# Altium project pump_controller_project.PrjPcb (part 1 of 2)
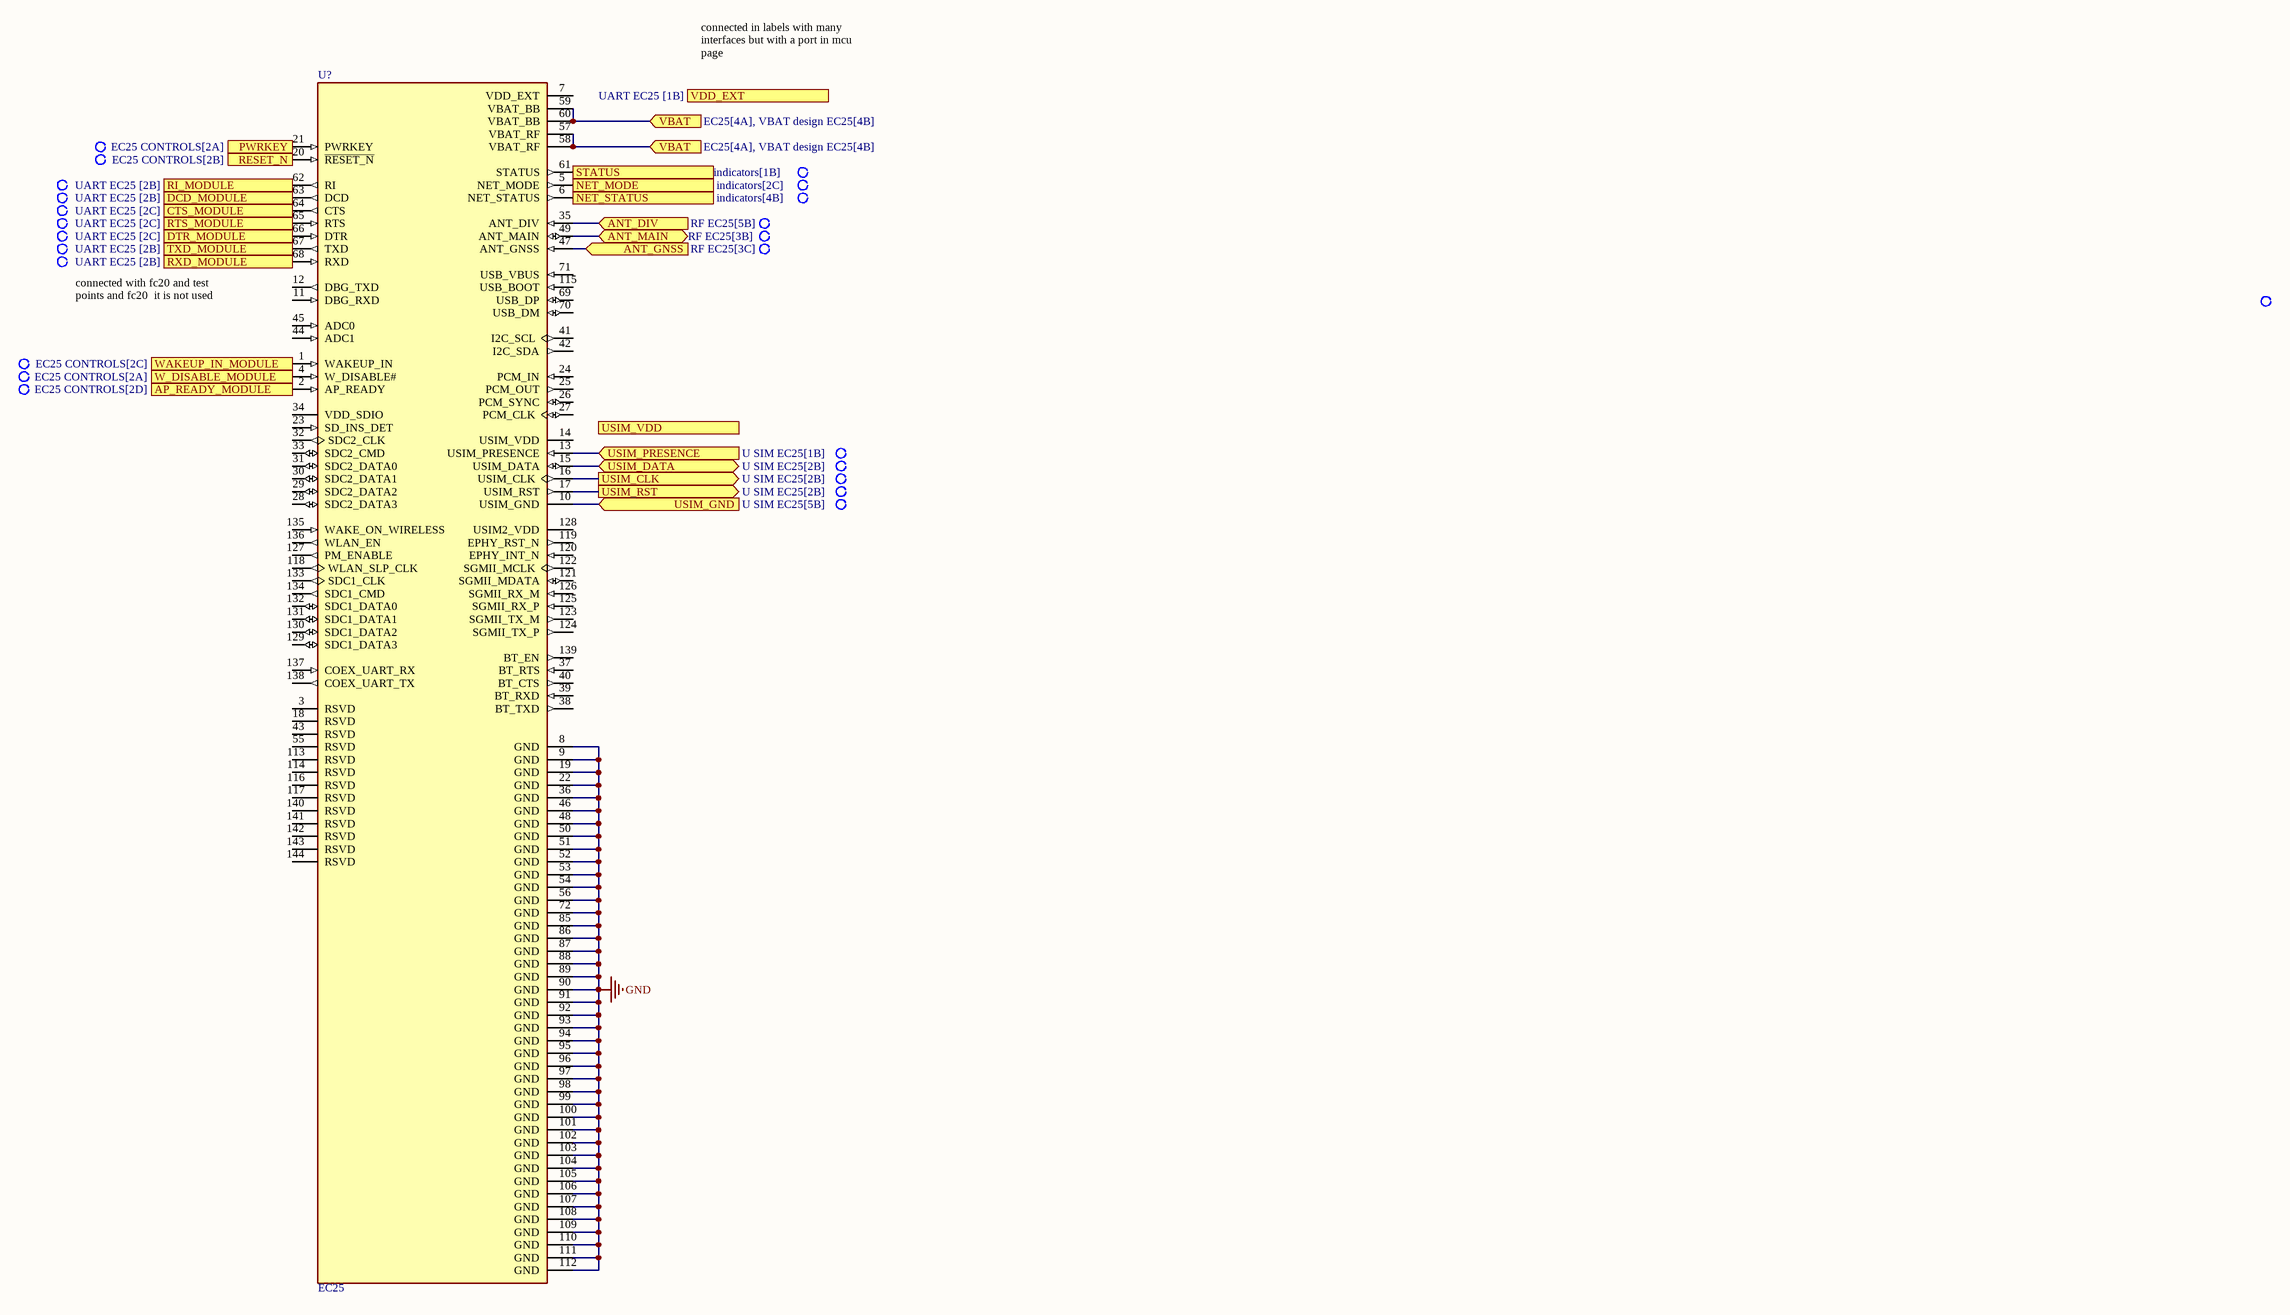
[diagram p0: EC25.SchDoc]
10 sheets, 163 parts. Net scope: flat (ports and power ports of the same name join across sheets).
Board file: PCB1.PcbDoc
Sheets:
  EC25.SchDoc
  UART EC25 .SchDoc
  LDO EC25.SchDoc
  U SIM EC25.SchDoc
  VBAT design EC25.SchDoc
  indicators.SchDoc
  ATWINC3400.SchDoc
  EC25 CONTROLS.SchDoc
  RF EC25.SchDoc
  MCU.SchDoc

## Sheet EC25.SchDoc
size C; SheetNumber: 4; SheetTotal: 10

### Parts
(Parts that share a designator on the sheet are numbered #1, #2 ... from top to bottom, then left to right.)
U?#1  EC25  [XCVR_EC25]

### Ports
ANT_DIV (in, see RF EC25[5B]), ANT_GNSS (in, see RF EC25[3C]), ANT_MAIN (bidir, see RF EC25[3B]), AP_READY_MODULE (in, see EC25 CONTROLS[2D]), CTS_MODULE (out, see UART EC25 [2C]), DCD_MODULE (out, see UART EC25 [2B]), DTR_MODULE (in, see UART EC25 [2C]), NET_MODE (out, see indicators[2C]), NET_STATUS (out, see indicators[4B]), PWRKEY (in, see EC25 CONTROLS[2A]), RESET_N (in, see EC25 CONTROLS[2B]), RI_MODULE (out, see UART EC25 [2B]), RTS_MODULE (in, see UART EC25 [2C]), RXD_MODULE (in, see UART EC25 [2B]), STATUS (out, see indicators[1B]), TXD_MODULE (out, see UART EC25 [2B]), USIM_CLK (out, see U SIM EC25[2B]), USIM_DATA (bidir, see U SIM EC25[2B]), USIM_GND (in, see U SIM EC25[5B]), USIM_PRESENCE (in, see U SIM EC25[1B]), USIM_RST (out, see U SIM EC25[2B]), USIM_VDD (out), VBAT (in, see EC25[4A], VBAT design EC25[4B]), VDD_EXT (out, see UART EC25 [1B]), W_DISABLE_MODULE (in, see EC25 CONTROLS[2A]), WAKEUP_IN_MODULE (in, see EC25 CONTROLS[2C])

### Nets
GND: U?#1.8(GND) U?#1.9(GND) U?#1.19(GND) U?#1.22(GND) U?#1.36(GND) U?#1.46(GND) U?#1.48(GND) U?#1.50(GND) U?#1.51(GND) U?#1.52(GND) U?#1.53(GND) U?#1.54(GND) U?#1.56(GND) U?#1.72(GND) U?#1.85(GND) U?#1.86(GND) U?#1.87(GND) U?#1.88(GND) U?#1.89(GND) U?#1.90(GND) U?#1.91(GND) U?#1.92(GND) U?#1.93(GND) U?#1.94(GND) U?#1.95(GND) U?#1.96(GND) U?#1.97(GND) U?#1.98(GND) U?#1.99(GND) U?#1.100(GND) U?#1.101(GND) U?#1.102(GND) U?#1.103(GND) U?#1.104(GND) U?#1.105(GND) U?#1.106(GND) U?#1.107(GND) U?#1.108(GND) U?#1.109(GND) U?#1.110(GND) U?#1.111(GND) U?#1.112(GND)  [project net VSS_1]
VBAT: U?#1.57(VBAT_RF) U?#1.58(VBAT_RF) U?#1.59(VBAT_BB) U?#1.60(VBAT_BB) ; port VBAT
NetC?#7_2: U?#1.10(USIM_GND) ; port USIM_GND
NetC?#23_2: U?#1.49(ANT_MAIN) ; port ANT_MAIN
NetC?#25_2: U?#1.35(ANT_DIV) ; port ANT_DIV
NetC?#27_1: U?#1.47(ANT_GNSS) ; port ANT_GNSS
NetD?#2_5: U?#1.13(USIM_PRESENCE) ; port USIM_PRESENCE
NetIC?#1_3: U?#1.63(DCD) ; port DCD_MODULE
NetIC?#1_4: U?#1.67(TXD) ; port TXD_MODULE
NetIC?#1_5: U?#1.68(RXD) ; port RXD_MODULE
NetIC?#1_6: U?#1.62(RI) ; port RI_MODULE
NetIC?#1_7: U?#1.66(DTR) ; port DTR_MODULE
NetIC?#1_8: U?#1.64(CTS) ; port CTS_MODULE
NetIC?#1_9: U?#1.65(RTS) ; port RTS_MODULE
NetQ?#3_1: U?#1.6(NET_STATUS) ; port NET_STATUS
NetQ?#4_1: U?#1.5(NET_MODE) ; port NET_MODE
NetQ?#5_3: U?#1.21(PWRKEY) ; port PWRKEY
NetQ?#6_3: U?#1.4(W_DISABLE#) ; port W_DISABLE_MODULE
NetQ?#7_3: U?#1.20(~{RESET_N}) ; port RESET_N
NetQ?#8_3: U?#1.1(WAKEUP_IN) ; port WAKEUP_IN_MODULE
NetQ?#9_3: U?#1.2(AP_READY) ; port AP_READY_MODULE
NetR?#9_1: U?#1.17(USIM_RST) ; port USIM_RST
NetR?#10_1: U?#1.16(USIM_CLK) ; port USIM_CLK
NetR?#11_1: U?#1.15(USIM_DATA) ; port USIM_DATA
NetR?#13_1: U?#1.61(STATUS) ; port STATUS

Not connected (* = marked no-connect by the designer): U?#1 3(RSVD) 7(VDD_EXT) 11(DBG_RXD) 12(DBG_TXD) 14(USIM_VDD) 18(RSVD) 23(SD_INS_DET) 24(PCM_IN) 25(PCM_OUT) 26(PCM_SYNC) 27(PCM_CLK) 28(SDC2_DATA3) 29(SDC2_DATA2) 30(SDC2_DATA1) 31(SDC2_DATA0) 32(SDC2_CLK) 33(SDC2_CMD) 34(VDD_SDIO) 37(BT_RTS) 38(BT_TXD) 39(BT_RXD) 40(BT_CTS) 41(I2C_SCL) 42(I2C_SDA) 43(RSVD) 44(ADC1) 45(ADC0) 55(RSVD) 69(USB_DP) 70(USB_DM) 71(USB_VBUS) 113(RSVD) 114(RSVD) 115(USB_BOOT) 116(RSVD) 117(RSVD) 118(WLAN_SLP_CLK) 119(EPHY_RST_N) 120(EPHY_INT_N) 121(SGMII_MDATA) 122(SGMII_MCLK) 123(SGMII_TX_M) 124(SGMII_TX_P) 125(SGMII_RX_P) 126(SGMII_RX_M) 127(PM_ENABLE) 128(USIM2_VDD) 129(SDC1_DATA3) 130(SDC1_DATA2) 131(SDC1_DATA1) 132(SDC1_DATA0) 133(SDC1_CLK) 134(SDC1_CMD) 135(WAKE_ON_WIRELESS) 136(WLAN_EN) 137(COEX_UART_RX) 138(COEX_UART_TX) 139(BT_EN) 140(RSVD) 141(RSVD) 142(RSVD) 143(RSVD) 144(RSVD)

### Notes on the sheet
- connected in labels with many interfaces but with a port in mcu page
- connected with fc20 and test points and fc20  it is not used

### Library data of the parts
U?#1 = EC25: LTE Cat 4 module; 32.0mm 29.0mm 2.4mm; Max. 150Mbps downlink / 50Mbps uplink; LCC form factor; Extended temperature range of -40C to +85C.; MF: Quectel; Availability: In Stock; Check_prices: https://www.snapeda.com/parts/EC25/Quectel/view-part/?ref=eda; Package: Custom Quectel; SnapEDA_Link: https://www.snapeda.com/parts/EC25/Quectel/view-part/?ref=snap; MP: EC25; Price: None; Value: *

## Sheet UART EC25 .SchDoc
size A; SheetNumber: 1; SheetTotal: 9
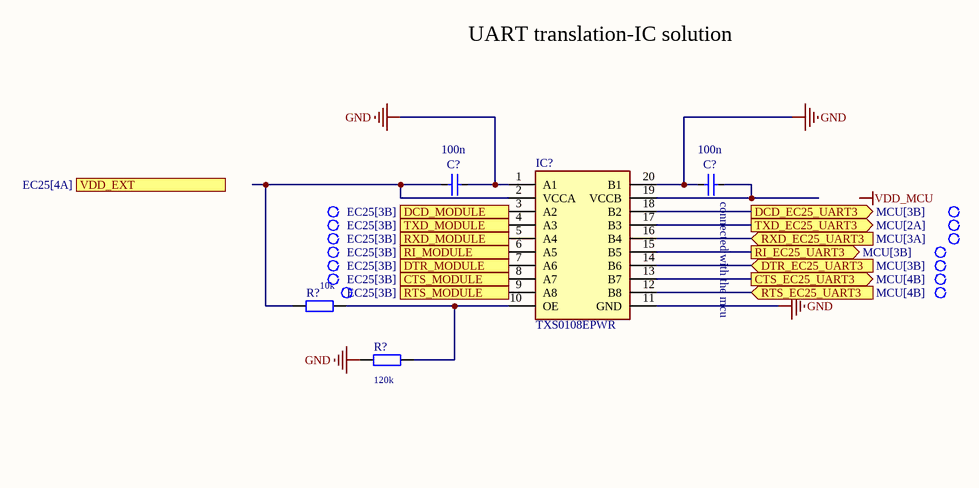
[diagram p1: UART EC25 .SchDoc]

### Parts
(Parts that share a designator on the sheet are numbered #1, #2 ... from top to bottom, then left to right.)
C?#1  value 100n  [CAPC1005X06N]  (hidden comment: C)
C?#2  value 100n  [CAPC1005X06N]  (hidden comment: C)
IC?#1  TXS0108EPWR  [SOP65P640X120-20N]
R?#1  value 10k  [RESC1005X04N]  (hidden comment: R)
R?#2  value 120k  [RESC1005X04N]  (hidden comment: R)

### Ports
CTS_EC25_UART3 (out, see MCU[4B]), CTS_MODULE (in, see EC25[3B]), DCD_EC25_UART3 (out, see MCU[3B]), DCD_MODULE (in, see EC25[3B]), DTR_EC25_UART3 (in, see MCU[3B]), DTR_MODULE (out, see EC25[3B]), RI_EC25_UART3 (out, see MCU[3B]), RI_MODULE (in, see EC25[3B]), RTS_EC25_UART3 (in, see MCU[4B]), RTS_MODULE (out, see EC25[3B]), RXD_EC25_UART3 (in, see MCU[3A]), RXD_MODULE (out, see EC25[3B]), TXD_EC25_UART3 (out, see MCU[2A]), TXD_MODULE (in, see EC25[3B]), VDD_EXT (in, see EC25[4A])

### Nets
GND: C?#1.2 C?#2.1 IC?#1.1(A1) IC?#1.11(GND) IC?#1.20(B1) R?#2.1  [project net VSS_1]
NetC?#1_1: C?#1.1 IC?#1.2(VCCA) R?#1.1
NetC?#2_2: C?#2.2 IC?#1.19(VCCB)
NetIC?#1_3: IC?#1.3(A2) ; port DCD_MODULE
NetIC?#1_4: IC?#1.4(A3) ; port TXD_MODULE
NetIC?#1_5: IC?#1.5(A4) ; port RXD_MODULE
NetIC?#1_6: IC?#1.6(A5) ; port RI_MODULE
NetIC?#1_7: IC?#1.7(A6) ; port DTR_MODULE
NetIC?#1_8: IC?#1.8(A7) ; port CTS_MODULE
NetIC?#1_9: IC?#1.9(A8) ; port RTS_MODULE
NetIC?#1_10: IC?#1.10(OE) R?#1.2 R?#2.2
NetIC?#1_12: IC?#1.12(B8) ; port RTS_EC25_UART3
NetIC?#1_13: IC?#1.13(B7) ; port CTS_EC25_UART3
NetIC?#1_14: IC?#1.14(B6) ; port DTR_EC25_UART3
NetIC?#1_15: IC?#1.15(B5) ; port RI_EC25_UART3
NetIC?#1_16: IC?#1.16(B4) ; port RXD_EC25_UART3
NetIC?#1_17: IC?#1.17(B3) ; port TXD_EC25_UART3
NetIC?#1_18: IC?#1.18(B2) ; port DCD_EC25_UART3

### Notes on the sheet
- UART translation-IC solution
- (near C?#2) connected with the mcu
- Labels drawn without touching a wire or pin: VDD_MCU

### Library data of the parts
IC?#1 = TXS0108EPWR: Integrated Circuit; Manufacturer_Name: Texas Instruments; Datasheet Link: http://www.ti.com/lit/ds/symlink/txs0108e.pdf; Height: 1.2mm; Manufacturer_Part_Number: TXS0108EPWR; Mouser Part Number: 595-TXS0108EPWR; Mouser Price/Stock: https://www.mouser.co.uk/ProductDetail/Texas-Instruments/TXS0108EPWR?qs=IUbkBnfnSQLgiWtCbWtYOw%3D%3D; Arrow Part Number: TXS0108EPWR; Arrow Price/Stock: https://www.arrow.com/en/products/txs0108epwr/texas-instruments?utm_currency=USD&region=nac
C?#1 C?#2 = C: MPN: *; Link: *
R?#1 R?#2 = R: MPN: *; Link: *

## Sheet LDO EC25.SchDoc
size A; SheetNumber: 2; SheetTotal: 9
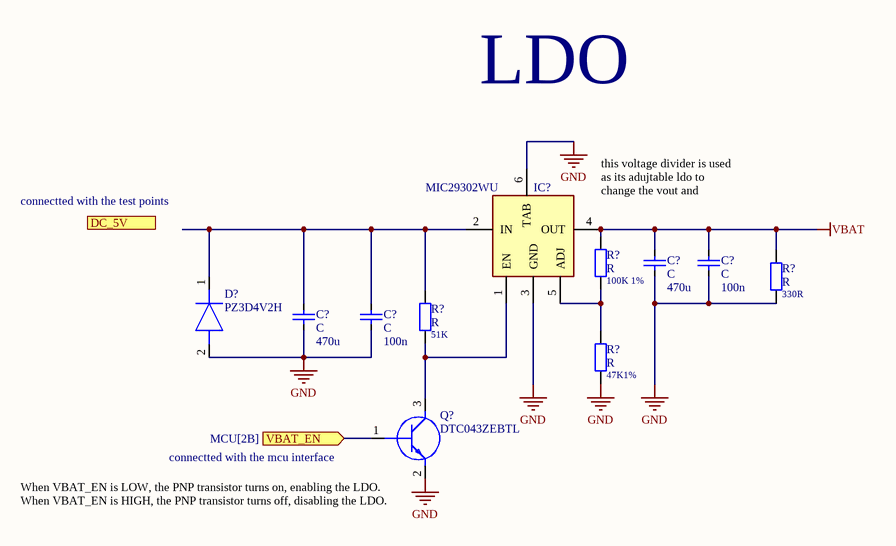
[diagram p2: LDO EC25.SchDoc]

### Parts
(Parts that share a designator on the sheet are numbered #1, #2 ... from top to bottom, then left to right.)
C?#3  C  value 470u  [CAPC1005X06N]
C?#4  C  value 100n  [CAPC1005X06N]
C?#5  C  value 470u  [CAPC1005X06N]
C?#6  C  value 100n  [CAPC1005X06N]
D?#1  PZ3D4V2H  [PZ3D4V2H]
IC?#2  MIC29302WU  [MIC29302WU]
Q?#1  DTC043ZEBTL  [SOTFL50P160X85-3N]
R?#3  R  value 100K 1%  [RESC1005X04N]
R?#4  R  value 330R  [RESC1005X04N]
R?#5  R  value 51K  [RESC1005X04N]
R?#6  R  value 47K1%  [RESC1005X04N]

### Ports
DC_5V (in), VBAT_EN (in, see MCU[2B])

### Nets
GND: C?#3.1 C?#4.1 C?#5.1 C?#6.1 D?#1.2(A) IC?#2.3(GND) IC?#2.6(TAB) Q?#1.2(E) R?#4.1 R?#6.1  [project net VSS_1]
VBAT: C?#3.2 C?#4.2 IC?#2.4(OUT) R?#3.2 R?#4.2
NetC?#5_2: C?#5.2 C?#6.2 D?#1.1(K) IC?#2.2(IN) R?#5.2
NetIC?#2_1: IC?#2.1(EN) Q?#1.3(C) R?#5.1
NetIC?#2_5: IC?#2.5(ADJ) R?#3.1 R?#6.2
NetIC?#4_8: Q?#1.1(B) ; port VBAT_EN

### Notes on the sheet
- LDO
- connectted with the test points
- (near IC?#2) this voltage divider is used as its adujtable ldo to change the vout and following the equation shown in the data sheet
- (near Q?#1) connectted with the mcu interface
- (near Q?#1) When VBAT_EN is LOW, the PNP transistor turns on, enabling the LDO.
  When VBAT_EN is HIGH, the PNP transistor turns off, disabling the LDO.

### Library data of the parts
D?#1 = PZ3D4V2H: Diode; Manufacturer_Name: Prisemi; Datasheet Link: http://www.prisemi.com/UploadImage/files/Zener/PZ3D4V2H.pdf; Height: 1mm; Manufacturer_Part_Number: PZ3D4V2H
IC?#2 = MIC29302WU: Integrated Circuit; Manufacturer_Name: Microchip; Datasheet Link: https://www.mouser.in/datasheet/2/268/MIC2915x_30x_50x_75x_High_Current_Low_Dropout_Regu-1889172.pdf; Height: 5.08mm; Manufacturer_Part_Number: MIC29302WU; Mouser Part Number: 998-MIC29302WU; Mouser Price/Stock: https://www.mouser.co.uk/ProductDetail/Microchip-Technology/MIC29302WU?qs=kh6iOki%2FeLGH5fS1ZBQ3pA%3D%3D; Arrow Part Number: MIC29302WU; Arrow Price/Stock: https://www.arrow.com/en/products/mic29302wu/microchip-technology?region=nac
Q?#1 = DTC043ZEBTL: Transistor BJT NPN; Manufacturer_Name: ROHM Semiconductor; Datasheet Link: http://rohmfs.rohm.com/en/products/databook/datasheet/discrete/transistor/digital/dtc043zmt2l-e.pdf; Height: 0.85mm; Manufacturer_Part_Number: DTC043ZEBTL; Mouser Part Number: 755-DTC043ZEBTL; Mouser Price/Stock: https://www.mouser.co.uk/ProductDetail/ROHM-Semiconductor/DTC043ZEBTL?qs=n7vHx8wJlDGyWrBOh0icRQ%3D%3D
C?#3-C?#6 = C: MPN: *; Link: *
R?#3-R?#6 = R: MPN: *; Link: *

## Sheet U SIM EC25.SchDoc
size 381 x 241 mm; SheetNumber: 5; SheetTotal: 9
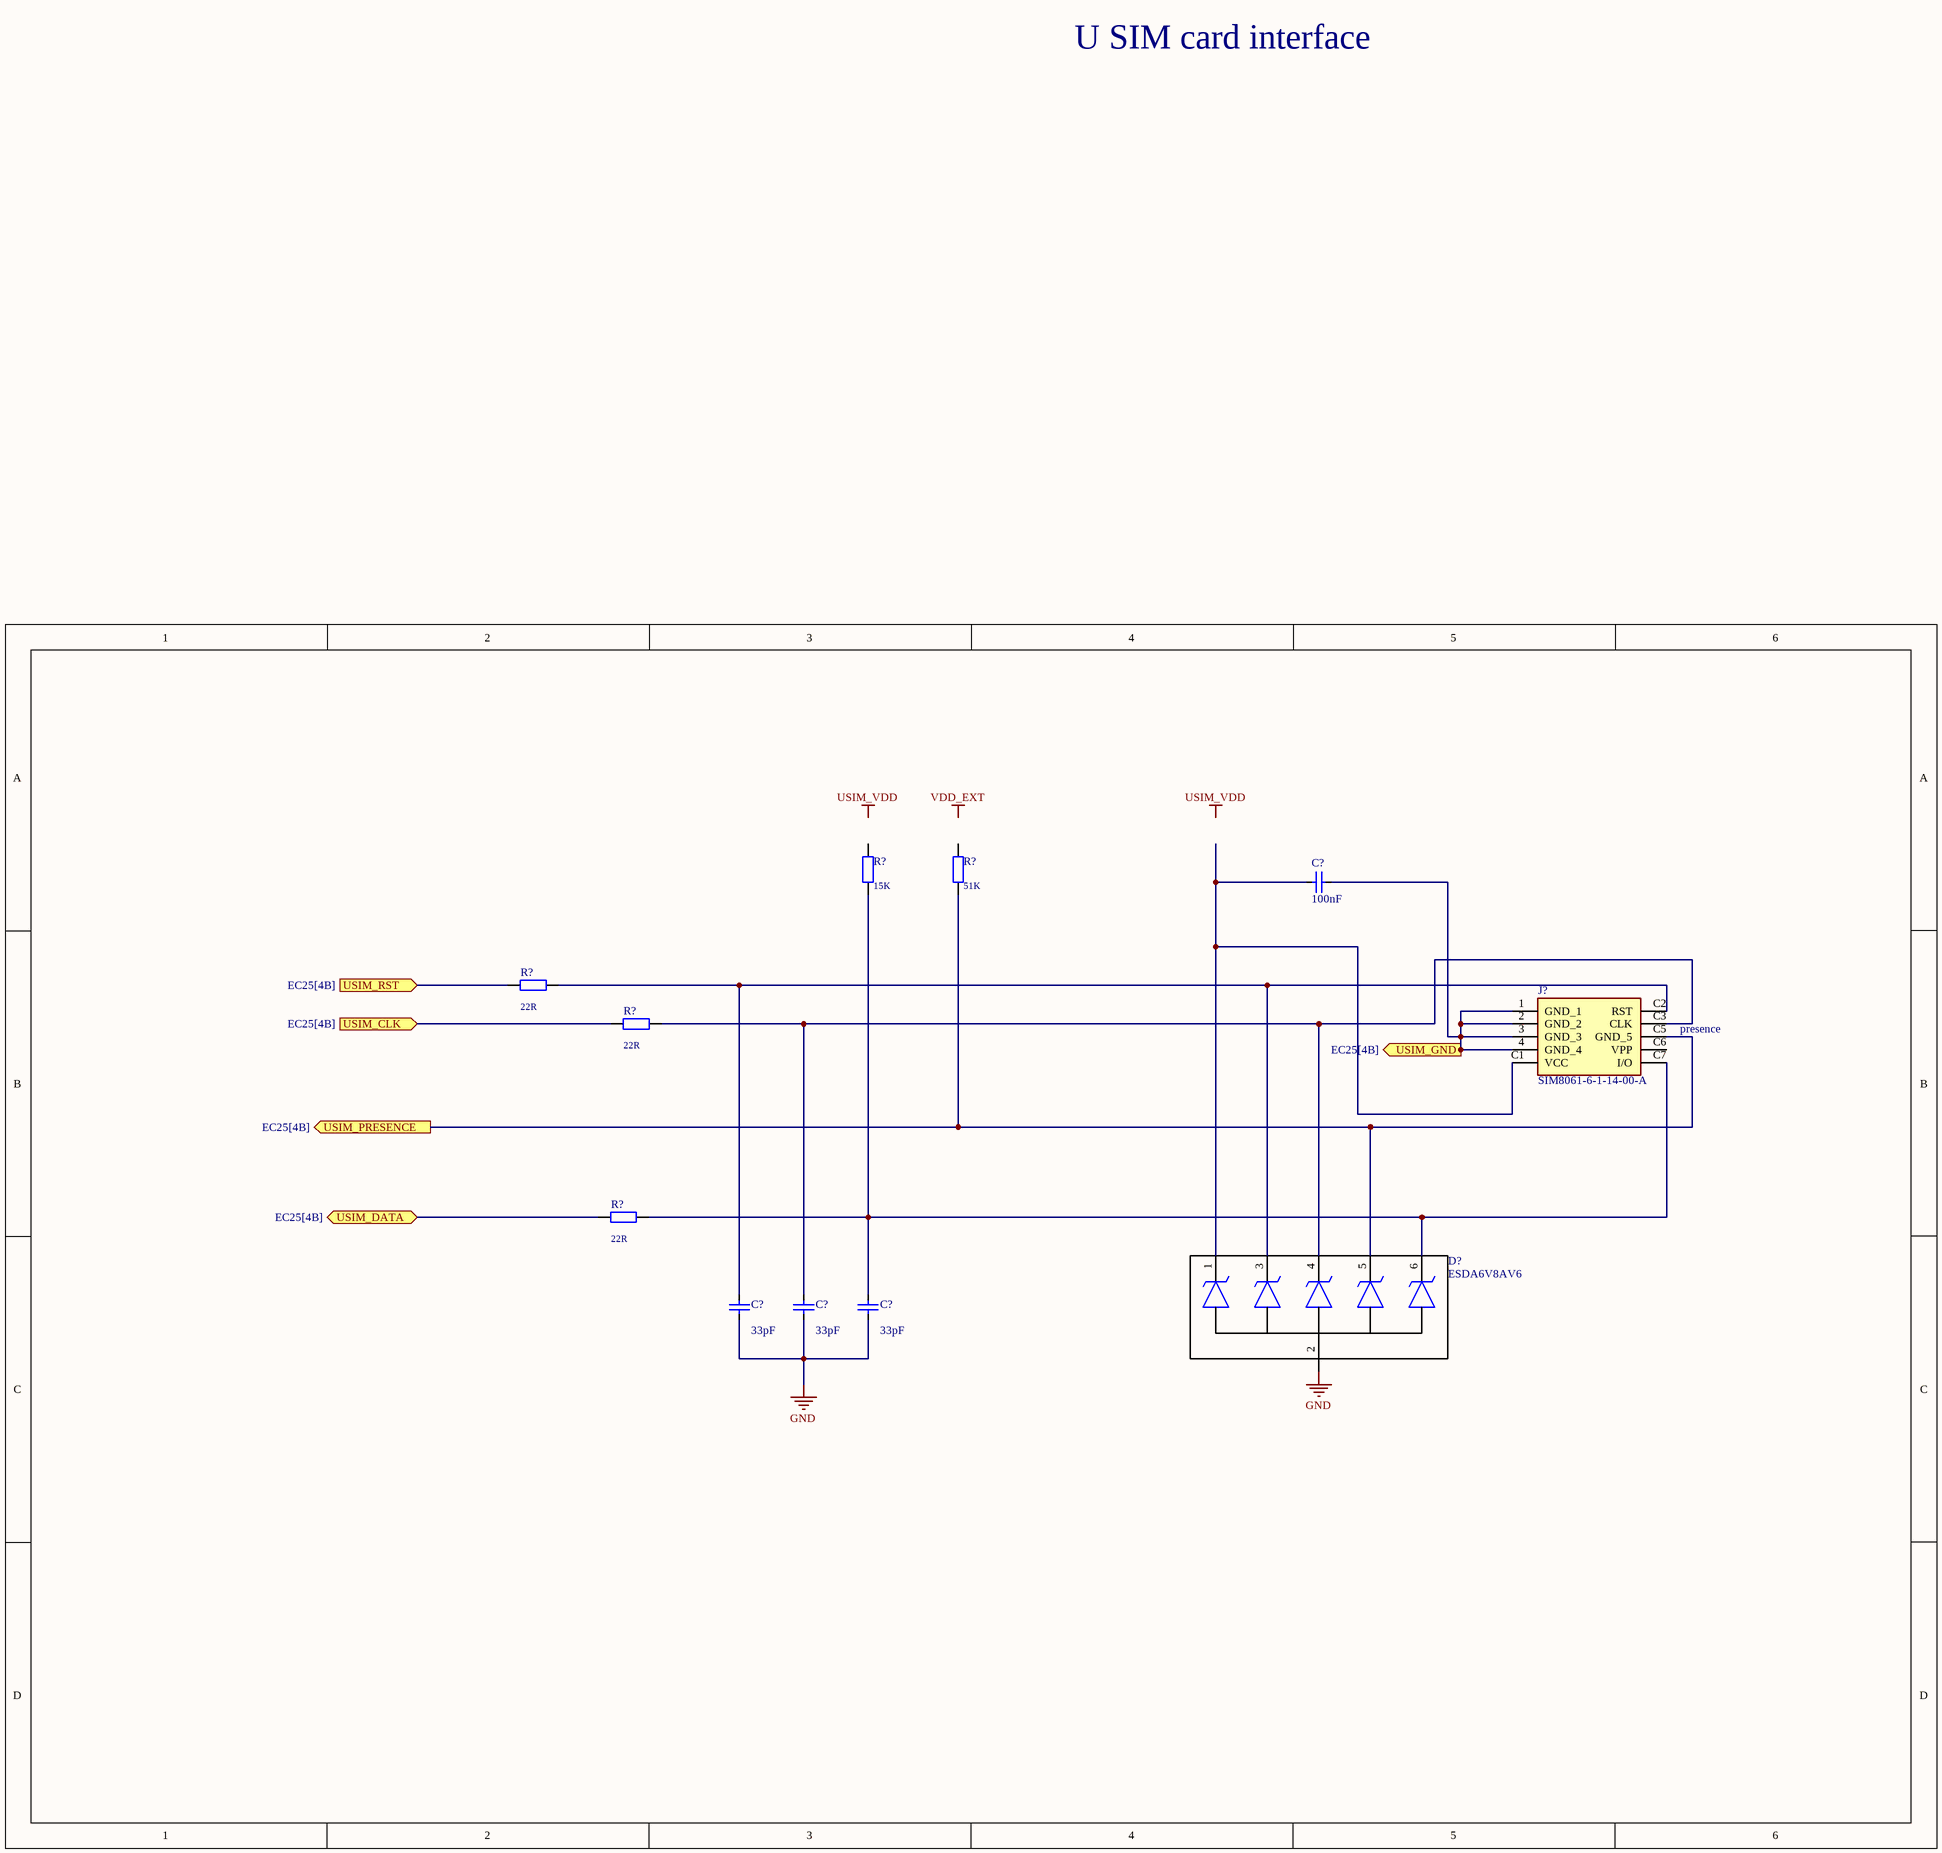
[diagram p3: U SIM EC25.SchDoc]

### Parts
(Parts that share a designator on the sheet are numbered #1, #2 ... from top to bottom, then left to right.)
C?#7  value 100nF  [CAPC1608X09N]  (hidden comment: C)
C?#8  value 33pF  [CAPC1608X09N]  (hidden comment: C)
C?#9  value 33pF  [CAPC1608X09N]  (hidden comment: C)
C?#10  value 33pF  [CAPC1608X09N]  (hidden comment: C)
D?#2  ESDA6V8AV6  [SOTFL50P160X60-6N]
J?#1  SIM8061-6-1-14-00-A  [SIM8061611400A]
R?#7  value 15K  [RESC1005X04N]  (hidden comment: R)
R?#8  value 51K  [RESC1005X04N]  (hidden comment: R)
R?#9  value 22R  [RESC1005X04N]  (hidden comment: R)
R?#10  value 22R  [RESC1005X04N]  (hidden comment: R)
R?#11  value 22R  [RESC1005X04N]  (hidden comment: R)

### Ports
USIM_CLK (in, see EC25[4B]), USIM_DATA (bidir, see EC25[4B]), USIM_GND (out, see EC25[4B]), USIM_PRESENCE (out, see EC25[4B]), USIM_RST (in, see EC25[4B])

### Nets
GND: C?#8.1 C?#9.1 C?#10.1 D?#2.2  [project net VSS_1]
NetC?#7_1: C?#7.1 D?#2.1 J?#1.C1(VCC)
NetC?#7_2: C?#7.2 J?#1.1(GND_1) J?#1.2(GND_2) J?#1.3(GND_3) J?#1.4(GND_4) ; port USIM_GND
NetC?#8_2: C?#8.2 D?#2.3 J?#1.C2(RST) R?#9.2
NetC?#9_2: C?#9.2 D?#2.4 J?#1.C3(CLK) R?#10.2
NetC?#10_2: C?#10.2 D?#2.6 J?#1.C7(I/O) R?#7.1 R?#11.2
NetD?#2_5: D?#2.5 J?#1.C5(GND_5) R?#8.1 ; port USIM_PRESENCE
NetR?#9_1: R?#9.1 ; port USIM_RST
NetR?#10_1: R?#10.1 ; port USIM_CLK
NetR?#11_1: R?#11.1 ; port USIM_DATA

Not connected (* = marked no-connect by the designer): J?#1 C6(VPP); R?#7 2; R?#8 2

### Notes on the sheet
- U SIM card interface
- (near J?#1) presence
- Labels drawn without touching a wire or pin: USIM_VDD, VDD_EXT

### Library data of the parts
D?#2 = ESDA6V8AV6: TVS Diode (Bi-directional); Manufacturer_Name: Will Semiconductor; Datasheet Link: http://www.chinesechip.com/files/2015-06/c6e5fabb-2b46-4fb6-8cff-c88a4d044cb1.pdf; Height: 0.6mm; Manufacturer_Part_Number: ESDA6V8AV6
J?#1 = SIM8061-6-1-14-00-A: Connector; Manufacturer_Name: GCT (GLOBAL CONNECTOR TECHNOLOGY); Datasheet Link: https://gct.co/connector/sim8061; Height: 1.58mm; Manufacturer_Part_Number: SIM8061-6-1-14-00-A; Mouser Part Number: 640-SIM8061611400A; Mouser Price/Stock: https://www.mouser.co.uk/ProductDetail/GCT/SIM8061-6-1-14-00-A?qs=%252BHhoWzUJg4JGbTNvJVYngw%3D%3D
C?#7-C?#10 = C: MPN: *; Link: *
R?#7-R?#11 = R: MPN: *; Link: *

## Sheet VBAT design EC25.SchDoc
size A; SheetNumber: 3; SheetTotal: 9
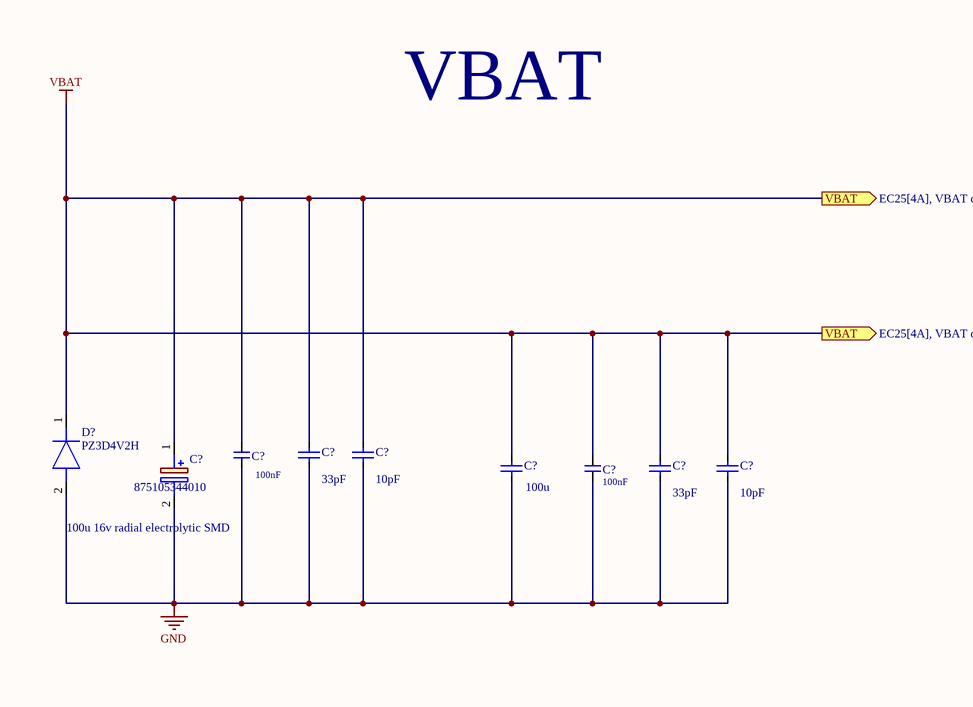
[diagram p4: VBAT design EC25.SchDoc, left]
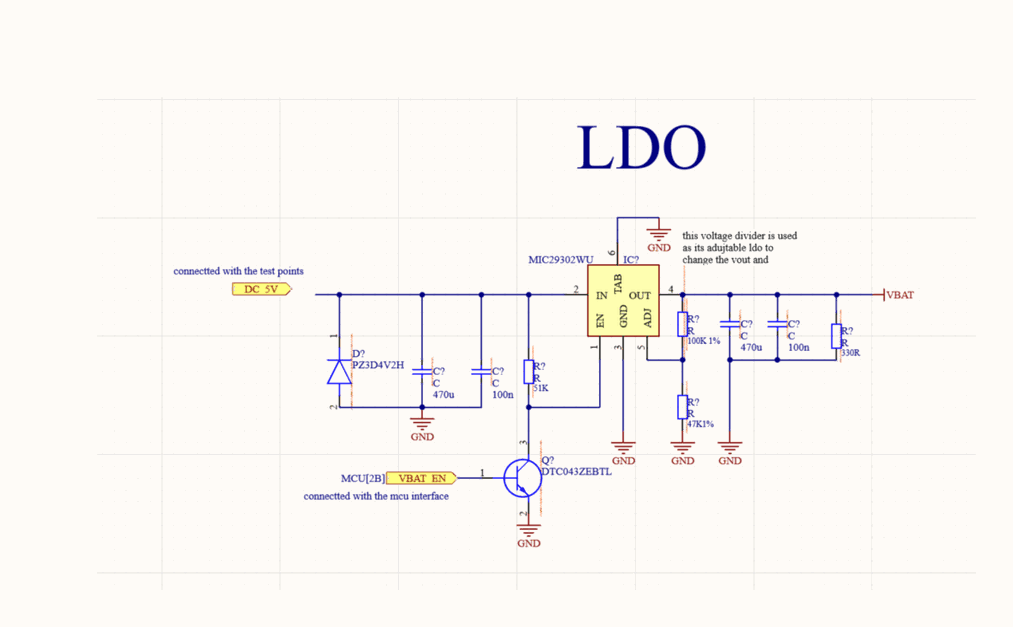
[diagram p5: VBAT design EC25.SchDoc, right]

### Parts
(Parts that share a designator on the sheet are numbered #1, #2 ... from top to bottom, then left to right.)
C?#11  875105344010  [CAPAE660X580N]
C?#12  value 100nF  [CAPC1005X06N]  (hidden comment: Cap)
C?#13  value 33pF  [CAPC1608X09N]  (hidden comment: C)
C?#14  value 10pF  [CAPC1608X09N]  (hidden comment: C)
C?#15  value 100nF  [CAPC1005X06N]  (hidden comment: Cap)
C?#16  value 100u  [CAPC1608X09N]  (hidden comment: C)
C?#17  value 33pF  [CAPC1608X09N]  (hidden comment: C)
C?#18  value 10pF  [CAPC1608X09N]  (hidden comment: C)
D?#3  PZ3D4V2H  [PZ3D4V2H]

### Ports
VBAT (out, see EC25[4A], VBAT design EC25[4B])

### Nets
GND: C?#11.2(-) C?#12.2 C?#13.1 C?#14.1 C?#15.2 C?#16.1 C?#17.1 C?#18.1 D?#3.2(A)  [project net VSS_1]
VBAT: C?#11.1(+) C?#12.1 C?#13.2 C?#14.2 C?#15.1 C?#16.2 C?#17.2 C?#18.2 D?#3.1(K) ; port VBAT

### Notes on the sheet
- VBAT
- 100u 16v radial electrolytic SMD

### Library data of the parts
C?#11 = 875105344010: Capacitor Polarised; Manufacturer_Name: Wurth Elektronik; Datasheet Link: https://katalog.we-online.de/pbs/datasheet/875105344010.pdf; Height: 5.8mm; Manufacturer_Part_Number: 875105344010; Mouser Part Number: 710-875105344010; Mouser Price/Stock: https://www.mouser.co.uk/ProductDetail/Wurth-Elektronik/875105344010?qs=0KOYDY2FL2%2F64TGt8E3UEQ%3D%3D
C?#12 C?#15 = Cap: Capacitor; MPN: GCM155R71H104KE02D; Link: https://jlcpcb.com/partdetail/MurataElectronics-GCM155R71H104KE02D/C85858; Price: 0.0031
D?#3 = PZ3D4V2H: Diode; Manufacturer_Name: Prisemi; Datasheet Link: http://www.prisemi.com/UploadImage/files/Zener/PZ3D4V2H.pdf; Height: 1mm; Manufacturer_Part_Number: PZ3D4V2H
C?#13 C?#14 C?#16-C?#18 = C: MPN: *; Link: *

## Sheet indicators.SchDoc
size A4; SheetNumber: 5; SheetTotal: 9
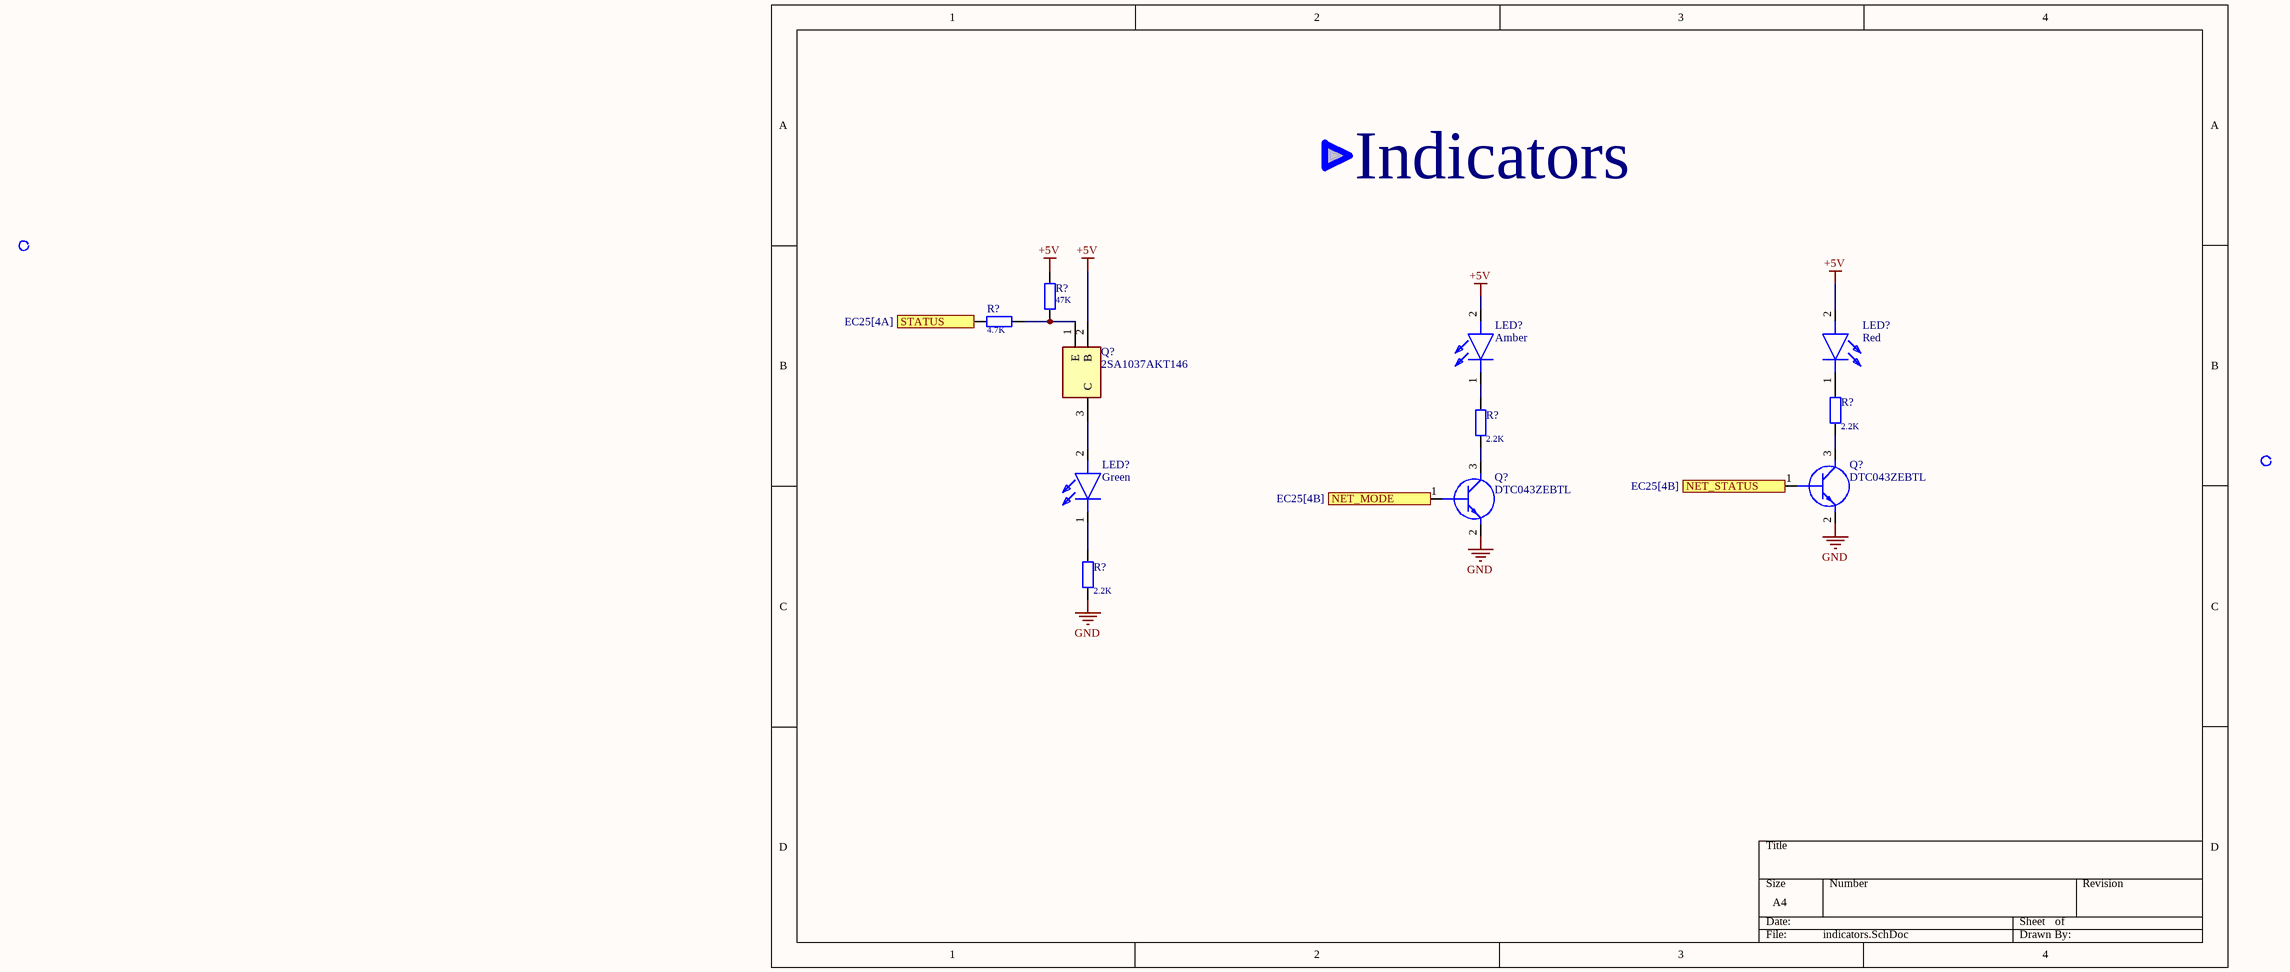
[diagram p6: indicators.SchDoc]

### Parts
(Parts that share a designator on the sheet are numbered #1, #2 ... from top to bottom, then left to right.)
LED?#1  Amber  [LEDC1608X80N]
LED?#2  Red  [LEDC1608X80N]
LED?#3  Green  [LEDC1608X80N]
Q?#2  2SA1037AKT146  [DTB123YKT146]
Q?#3  DTC043ZEBTL  [SOTFL50P160X85-3N]
Q?#4  DTC043ZEBTL  [SOTFL50P160X85-3N]
R?#12  value 47K  [RESC1005X04N]  (hidden comment: R)
R?#13  value 4.7K  [RESC1005X04N]  (hidden comment: R)
R?#14  value 2.2K  [RESC1005X04N]  (hidden comment: R)
R?#15  value 2.2K  [RESC1005X04N]  (hidden comment: R)
R?#16  value 2.2K  [RESC1005X04N]  (hidden comment: R)

### Ports
NET_MODE (in, see EC25[4B]), NET_STATUS (in, see EC25[4B]), STATUS (in, see EC25[4A])

### Nets
+5V: LED?#1.2(A) LED?#2.2(A) Q?#2.2(B) R?#12.1
GND: Q?#3.2(E) Q?#4.2(E) R?#16.1  [project net VSS_1]
NetLED?#1_1: LED?#1.1(K) R?#15.2
NetLED?#2_1: LED?#2.1(K) R?#14.2
NetLED?#3_1: LED?#3.1(K) R?#16.2
NetLED?#3_2: LED?#3.2(A) Q?#2.3(C)
NetQ?#2_1: Q?#2.1(E) R?#12.2 R?#13.2
NetQ?#3_1: Q?#3.1(B) ; port NET_STATUS
NetQ?#3_3: Q?#3.3(C) R?#14.1
NetQ?#4_1: Q?#4.1(B) ; port NET_MODE
NetQ?#4_3: Q?#4.3(C) R?#15.1
NetR?#13_1: R?#13.1 ; port STATUS

### Notes on the sheet
- Indicators

### Library data of the parts
LED?#1 = 150060SS75000: LED; Manufacturer_Name: Wurth Elektronik; MPN: BL-HJC36G-AV-TRB; Height: 0.8mm; Mouser Part Number: 710-150060SS75000; Mouser Price/Stock: https://www.mouser.co.uk/ProductDetail/Wurth-Elektronik/150060SS75000?qs=LlUlMxKIyB0oQaxwspeTEA%3D%3D; Price: 0.; Link: https://www.lcsc.com/product-detail/LED-Indication-Discrete_BrtLed-Bright-LED-Elec-BL-HJC36G-AV-TRB_C165983.html?s_z=n_led%200603
LED?#2 = 150060SS75000: LED; Manufacturer_Name: Wurth Elektronik; MPN: XL-1608SURC-06; Height: 0.8mm; Mouser Part Number: 710-150060SS75000; Mouser Price/Stock: https://www.mouser.co.uk/ProductDetail/Wurth-Elektronik/150060SS75000?qs=LlUlMxKIyB0oQaxwspeTEA%3D%3D; Price: 0.003; Link: https://www.lcsc.com/product-detail/LED-Indication-Discrete_XINGLIGHT-XL-1608SURC-06_C965799.html
LED?#3 = 150060SS75000: LED; Manufacturer_Name: Wurth Elektronik; MPN: XL-1608UGC-04; Height: 0.8mm; Mouser Part Number: 710-150060SS75000; Mouser Price/Stock: https://www.mouser.co.uk/ProductDetail/Wurth-Elektronik/150060SS75000?qs=LlUlMxKIyB0oQaxwspeTEA%3D%3D; Price: 0.0041; Link: https://www.lcsc.com/product-detail/LED-Indication-Discrete_XINGLIGHT-XL-1608UGC-04_C965804.html
Q?#2 = 2SA1037AKT146: Transistor; Manufacturer_Name: ROHM Semiconductor; Height: 1mm; Manufacturer_Part_Number: 2SA1037AKT146; Mouser Part Number: N/A; Mouser Price/Stock: https://www.mouser.co.uk/ProductDetail/ROHM-Semiconductor/2SA1037AKT146?qs=zGux8KhMp6Koqnkrd3X73Q%3D%3D
Q?#3 Q?#4 = DTC043ZEBTL: as Q?#1 on sheet LDO EC25; Datasheet Link: http://rohmfs.rohm.com/en/products/databook/datasheet/discrete/transistor/digital/dtc043zmt2l-e.pdf; Height: 0.85mm; Manufacturer_Part_Number: DTC043ZEBTL; Mouser Part Number: 755-DTC043ZEBTL; Mouser Price/Stock: https://www.mouser.co.uk/ProductDetail/ROHM-Semiconductor/DTC043ZEBTL?qs=n7vHx8wJlDGyWrBOh0icRQ%3D%3D
R?#12-R?#16 = R: MPN: *; Link: *

## Sheet ATWINC3400.SchDoc
size C; SheetNumber: 6; SheetTotal: 9
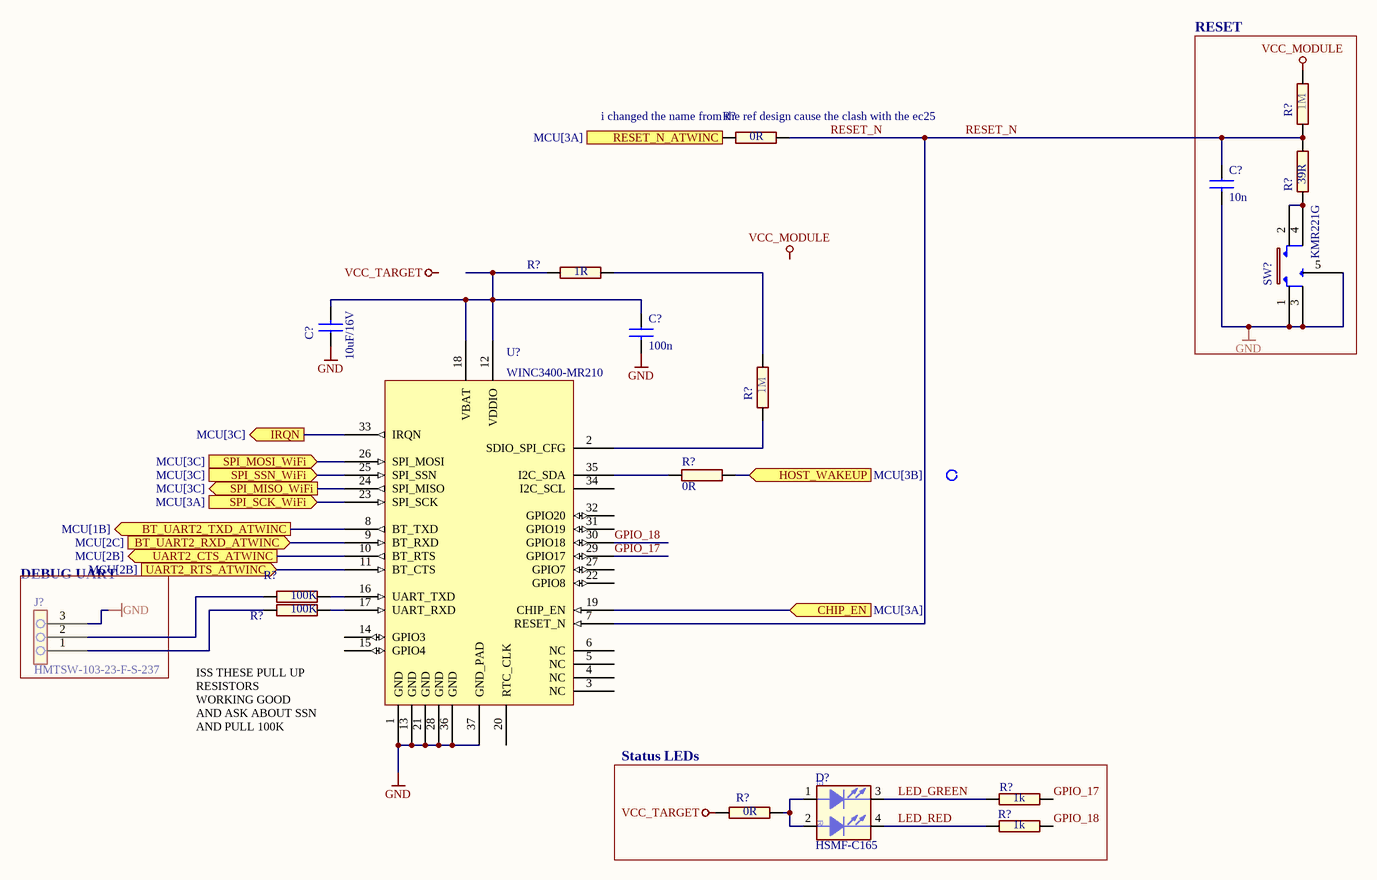
[diagram p7: ATWINC3400.SchDoc]

### Parts
(Parts that share a designator on the sheet are numbered #1, #2 ... from top to bottom, then left to right.)
C?#19  value 10n  [AP1-00001]
C?#20  value 100n  [AP1-00001]
C?#21  value 10uF/16V  [AP1-00039]
D?#4  value HSMF-C165  [AP4-00132]
J?#2  value HMTSW-103-23-F-S-237  [AP8-00745]  (hidden comment: Same as A08-1614 but with 1mm hole for optimal reflow soldering (no misalignment of the component))
R?#17  value 0R  [AP2-00011]
R?#18  value 1M  [AP2-00000]
R?#19  value 39R  [AP2-00000]
R?#20  value 1R  [AP2-00011]
R?#21  value 1M  [AP2-00000]
R?#22  value 0R  [AP2-00011]
R?#23  value 100K  [AP2-00011]
R?#24  value 100K  [AP2-00011]
R?#25  value 1k  [AP2-00000]
R?#26  value 0R  [AP2-00011]
R?#27  value 1k  [AP2-00000]
SW?  value KMR221G  [AP8-00274]
U?#2  value WINC3400-MR210  [AP9-00147]

### Blocks framed on the sheet
RESET: C?#19 R?#18 R?#19 SW?
DEBUG UART: J?#2
Status LEDs: D?#4 R?#25-R?#27

### Ports
BT_UART2_RXD_ATWINC (in, see MCU[2C]), BT_UART2_TXD_ATWINC (out, see MCU[1B]), CHIP_EN (in, see MCU[3A]), HOST_WAKEUP (in, see MCU[3B]), IRQN (out, see MCU[3C]), RESET_N_ATWINC (in, see MCU[3A]), SPI_MISO_WiFi (out, see MCU[3C]), SPI_MOSI_WiFi (in, see MCU[3C]), SPI_SCK_WiFi (in, see MCU[3A]), SPI_SSN_WiFi (in, see MCU[3C]), UART2_CTS_ATWINC (out, see MCU[2B]), UART2_RTS_ATWINC (in, see MCU[2B])

### Nets
GND: C?#19.2 C?#20.2 C?#21.1 J?#2.3 SW?.1 SW?.3 SW?.5(GND) U?#2.1(GND) U?#2.13(GND) U?#2.21(GND) U?#2.28(GND) U?#2.36(GND) U?#2.37(GND_PAD)  [project net VSS_1]
VCC_MODULE: R?#18.2
VCC_TARGET: R?#26.2
GPIO_17: R?#25.2 U?#2.29(GPIO17)
GPIO_18: R?#27.2 U?#2.30(GPIO18)
LED_GREEN: D?#4.3(CATHODE3) R?#25.1
LED_RED: D?#4.4(CATHODE4) R?#27.1
RESET_N: C?#19.1 R?#17.1 R?#18.1 R?#19.2 U?#2.7(RESET_N)
NetC?#20_1: C?#20.1 C?#21.2 R?#20.2 U?#2.12(VDDIO) U?#2.18(VBAT)
NetD?#4_1: D?#4.1(ANODE1) D?#4.2(ANODE2) R?#26.1
NetIC?#4_12: U?#2.10(BT_RTS) ; port UART2_CTS_ATWINC
NetIC?#4_13: U?#2.11(BT_CTS) ; port UART2_RTS_ATWINC
NetIC?#4_14: U?#2.8(BT_TXD) ; port BT_UART2_TXD_ATWINC
NetIC?#4_17: U?#2.9(BT_RXD) ; port BT_UART2_RXD_ATWINC
NetIC?#4_20: U?#2.24(SPI_MISO) ; port SPI_MISO_WiFi
NetIC?#4_21: U?#2.26(SPI_MOSI) ; port SPI_MOSI_WiFi
NetIC?#4_25: U?#2.33(IRQN) ; port IRQN
NetIC?#4_30: U?#2.25(SPI_SSN) ; port SPI_SSN_WiFi
NetIC?#4_41: R?#22.1 ; port HOST_WAKEUP
NetIC?#4_55: U?#2.19(CHIP_EN) ; port CHIP_EN
NetIC?#4_56: U?#2.23(SPI_SCK) ; port SPI_SCK_WiFi
NetIC?#4_57: R?#17.2 ; port RESET_N_ATWINC
NetJ?#2_1: J?#2.1 R?#24.2
NetJ?#2_2: J?#2.2 R?#23.2
NetR?#19_1: R?#19.1 SW?.2 SW?.4
NetR?#20_1: R?#20.1 R?#21.2
NetR?#21_1: R?#21.1 U?#2.2(SDIO_SPI_CFG)
NetR?#22_2: R?#22.2 U?#2.35(I2C_SDA)
NetR?#23_1: R?#23.1 U?#2.16(UART_TXD)
NetR?#24_1: R?#24.1 U?#2.17(UART_RXD)

Not connected (* = marked no-connect by the designer): U?#2 3(NC) 4(NC) 5(NC) 6(NC) 14(GPIO3) 15(GPIO4) 20(RTC_CLK) 22(GPIO8) 27(GPIO7) 31(GPIO19) 32(GPIO20) 34(I2C_SCL)

### Notes on the sheet
- (near R?#17) i changed the name from the ref design cause the clash with the ec25
- ISS THESE PULL UP RESISTORS WORKING GOOD AND ASK ABOUT SSN AND PULL 100K THAT NEEDED TO BE PUT
- Labels drawn without touching a wire or pin: VCC_MODULE, VCC_TARGET
- (in symbol A10-0154) G; R

### Library data of the parts
C?#19 = A01-0050: Ceramic capacitor, SMD 0402, X7R, 25V, +/-10%; PartGroup: Capacitors,Ceramic,SMD 0402; TemperatureRange: -55 - +125 deg C; ComponentStatus: 'Active (verified)'; Status: Active; Verified by: Lars Helge Mo; Verified date: 2005-12-15; AN: A01-0050; Tolerance: 25V, +/-10%; Height: 0.550000011920929; FootprintStatus: 'Active (Verified)'
C?#20 = A01-0246: Ceramic capacitor, SMD 0402, X7R, 16V, +/-10%; PartGroup: Capacitors,Ceramic,SMD 0402; Manufacturer: Kemet; MPN: C0402C104K4RACTU; TemperatureRange: -55 - +125 deg C; ComponentStatus: 'Active (verified)'; Status: Active; Verified by: Lars Helge Mo; Verified date: 2005-12-15; AN: A01-0246; Tolerance: 16V, +/-10%; Height: 0.5; FootprintStatus: 'Active (Verified)'
C?#21 = A01-0491: Ceramic capacitor, SMD 0603, X5R, 16V, 10UF ± 20% (High Density); PartGroup: Capacitors,Ceramic,SMD 0603; Manufacturer: Taiyo Yuden; MPN: EMK107BBJ106MA-T; ComponentStatus: 'Active (verified)'; TemperatureRange: -55°C to +85°C; Tolerance: ­± 20%; Status: Active; Verified by: Lars Helge Mo; Verified date: 2005-12-15; AN: A01-0491; FootprintStatus: 'Active (Verified)'; Height: 0.819999992847443
D?#4 = A10-0154: LED, Bicolor, Red/Green, Diffused, 1.6x0.8mm; PartGroup: Opto,LEDs,SMD; Manufacturer: Avago Technologies; TemperatureRange: -30Â°C to 85Â°C; ComponentStatus: 'Active (verified)'; AN: A10-0154; Height: 0.5; MPN: HSMF-C165; FootprintStatus: 'Active (Verified)'
J?#2 = A08-1799: 1x3 pin header, 2.54mm pitch, Pin-in-Paste THM, 1mm hole; PartGroup: Mechanical devices,Connectors,Pin headers; Manufacturer: SAMTEC; ComponentStatus: 'Active (verified)'; Verified date: 2006-01-30; Verified by: Lars Helge Mo; Status: Active; AN: A08-1799; Height: 6.09999990463257; MPN: HMTSW-103-23-F-S-237; FootprintStatus: 'Active (Verified)'
R?#17 R?#20 R?#22-R?#24 R?#26 = A02-0163: RES 0.0 OHM 1/16W 0402 SMD; PartGroup: Resistors,SMD,0402 1%; MPN: RMCF0402ZT0R00; Manufacturer: (n/a); Tolerance: 1 %; TemperatureRange: -55 - +125 deg C; ComponentStatus: 'Active (verified)'; Status: Active; Verified by: Lars Helge Mo; Verified date: 2005-12-19; AN: A02-0163; Height: 0.349999994039536; FootprintStatus: 'Active (Verified)'
R?#18 R?#21 = A02-0284: Thick film resistor, SMD 0402, 1/16W, 1%; PartGroup: Resistors,SMD,0402 1%; TemperatureRange: -55 - +125 deg C; ComponentStatus: 'Active (verified)'; Status: Active; Verified by: Lars Helge Mo; Verified date: 2005-12-19; AN: A02-0284; Tolerance: 1 %; Height: 0.349999994039536; FootprintStatus: 'Active (Verified)'
R?#19 = A02-0178: Thick film resistor, SMD 0402, 1/16W, 1%; PartGroup: Resistors,SMD,0402 1%; TemperatureRange: -55 - +125 deg C; ComponentStatus: 'Active (verified)'; Status: Active; Verified by: Lars Helge Mo; Verified date: 2005-12-19; AN: A02-0178; Tolerance: 1 %; Height: 0.349999994039536; FootprintStatus: 'Active (Verified)'
R?#25 R?#27 = A02-0212: Thick film resistor, SMD 0402, 1/16W, 1%; PartGroup: Resistors,SMD,0402 1%; TemperatureRange: -55 - +125 deg C; ComponentStatus: 'Active (verified)'; Status: Active; Verified by: Lars Helge Mo; Verified date: 2005-12-19; AN: A02-0212; Tolerance: 1 %; Height: 0.349999994039536; FootprintStatus: 'Active (Verified)'
SW? = A08-0420: Microminiature Tact Switch for SMT; PartGroup: Mechanical devices,Switches,SMD; Manufacturer: ITT cannon; ComponentStatus: 'Active (verified)'; Status: Active; Verified by: Ketil Skjerve; Verified date: 2006-03-15; AN: A08-0420; Height: 1.89999997615814; MPN: KMR221G; FootprintStatus: 'Active (Verified)'
U?#2 = A06-1356: IEEE 802.11 b/g/n Link Controller with Integrated Low Energy Bluetooth 4.0; PartGroup: Integrated Circuits,Interface ICs,RF; Manufacturer: ATMEL; TemperatureRange: -40Â°C to +85Â°C; ComponentStatus: 'New (not verified)'; AN: A06-1356; MPN: WINC3400-MR210; FootprintStatus: 'Active (Verified)'

## Sheet EC25 CONTROLS.SchDoc
size A; SheetNumber: 7; SheetTotal: 9
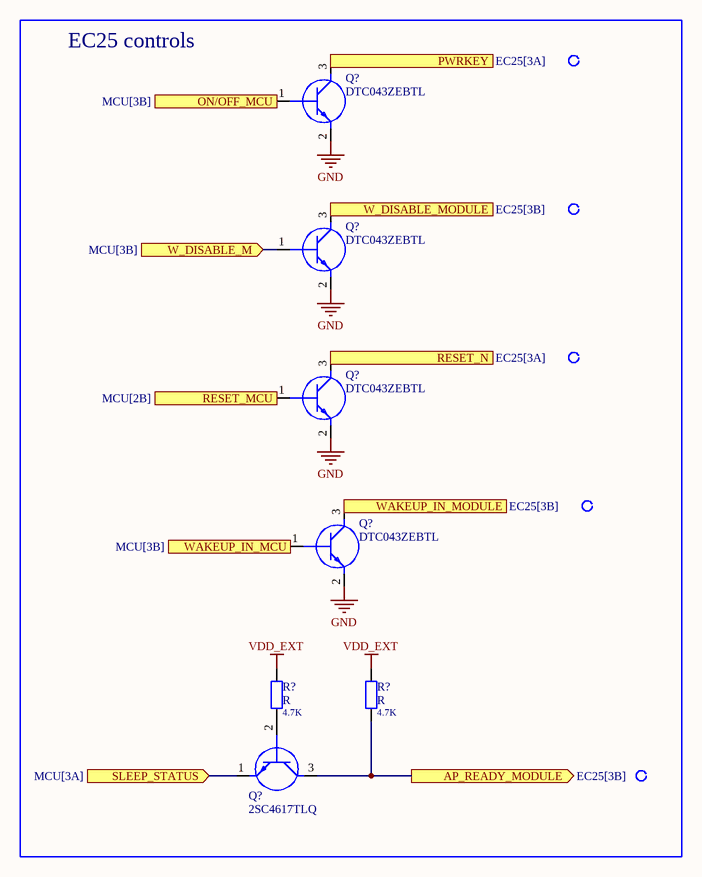
[diagram p8: EC25 CONTROLS.SchDoc]

### Parts
(Parts that share a designator on the sheet are numbered #1, #2 ... from top to bottom, then left to right.)
Q?#5  DTC043ZEBTL  [SOTFL50P160X85-3N]
Q?#6  DTC043ZEBTL  [SOTFL50P160X85-3N]
Q?#7  DTC043ZEBTL  [SOTFL50P160X85-3N]
Q?#8  DTC043ZEBTL  [SOTFL50P160X85-3N]
Q?#9  2SC4617TLQ  [2SC4617TLQ]
R?#28  R  value 4.7K  [RESC1005X04N]
R?#29  R  value 4.7K  [RESC1005X04N]

### Blocks framed on the sheet
EC25 controls: Q?#5-Q?#9 R?#28 R?#29

### Ports
AP_READY_MODULE (out, see EC25[3B]), ON/OFF_MCU (in, see MCU[3B]), PWRKEY (out, see EC25[3A]), RESET_MCU (in, see MCU[2B]), RESET_N (out, see EC25[3A]), SLEEP_STATUS (in, see MCU[3A]), W_DISABLE_M (in, see MCU[3B]), W_DISABLE_MODULE (out, see EC25[3B]), WAKEUP_IN_MCU (in, see MCU[3B]), WAKEUP_IN_MODULE (out, see EC25[3B])

### Nets
GND: Q?#5.2(E) Q?#6.2(E) Q?#7.2(E) Q?#8.2(E)  [project net VSS_1]
VDD_EXT: R?#28.2 R?#29.2
NetIC?#4_10: Q?#7.1(B) ; port RESET_MCU
NetIC?#4_42: Q?#5.1(B) ; port ON/OFF_MCU
NetIC?#4_43: Q?#6.1(B) ; port W_DISABLE_M
NetIC?#4_44: Q?#8.1(B) ; port WAKEUP_IN_MCU
NetIC?#4_52: Q?#9.1(E) ; port SLEEP_STATUS
NetQ?#5_3: Q?#5.3(C) ; port PWRKEY
NetQ?#6_3: Q?#6.3(C) ; port W_DISABLE_MODULE
NetQ?#7_3: Q?#7.3(C) ; port RESET_N
NetQ?#8_3: Q?#8.3(C) ; port WAKEUP_IN_MODULE
NetQ?#9_2: Q?#9.2(B) R?#28.1
NetQ?#9_3: Q?#9.3(C) R?#29.1 ; port AP_READY_MODULE

### Library data of the parts
Q?#5-Q?#8 = DTC043ZEBTL: as Q?#1 on sheet LDO EC25; Datasheet Link: http://rohmfs.rohm.com/en/products/databook/datasheet/discrete/transistor/digital/dtc043zmt2l-e.pdf; Height: 0.85mm; Manufacturer_Part_Number: DTC043ZEBTL; Mouser Part Number: 755-DTC043ZEBTL; Mouser Price/Stock: https://www.mouser.co.uk/ProductDetail/ROHM-Semiconductor/DTC043ZEBTL?qs=n7vHx8wJlDGyWrBOh0icRQ%3D%3D
Q?#9 = 2SC4617TLQ: Transistor BJT NPN; Manufacturer_Name: ROHM Semiconductor; Datasheet Link: https://componentsearchengine.com/Datasheets/1/2SC4617TLQ.pdf; Height: 0.8mm; Manufacturer_Part_Number: 2SC4617TLQ; Mouser Part Number: 755-2SC4617TLQ; Mouser Price/Stock: https://www.mouser.co.uk/ProductDetail/ROHM-Semiconductor/2SC4617TLQ?qs=4kLU8WoGk0sY2QY7rUsyQw%3D%3D
R?#28 R?#29 = R: MPN: *; Link: *

## Sheet RF EC25.SchDoc
size B; SheetNumber: 8; SheetTotal: 9
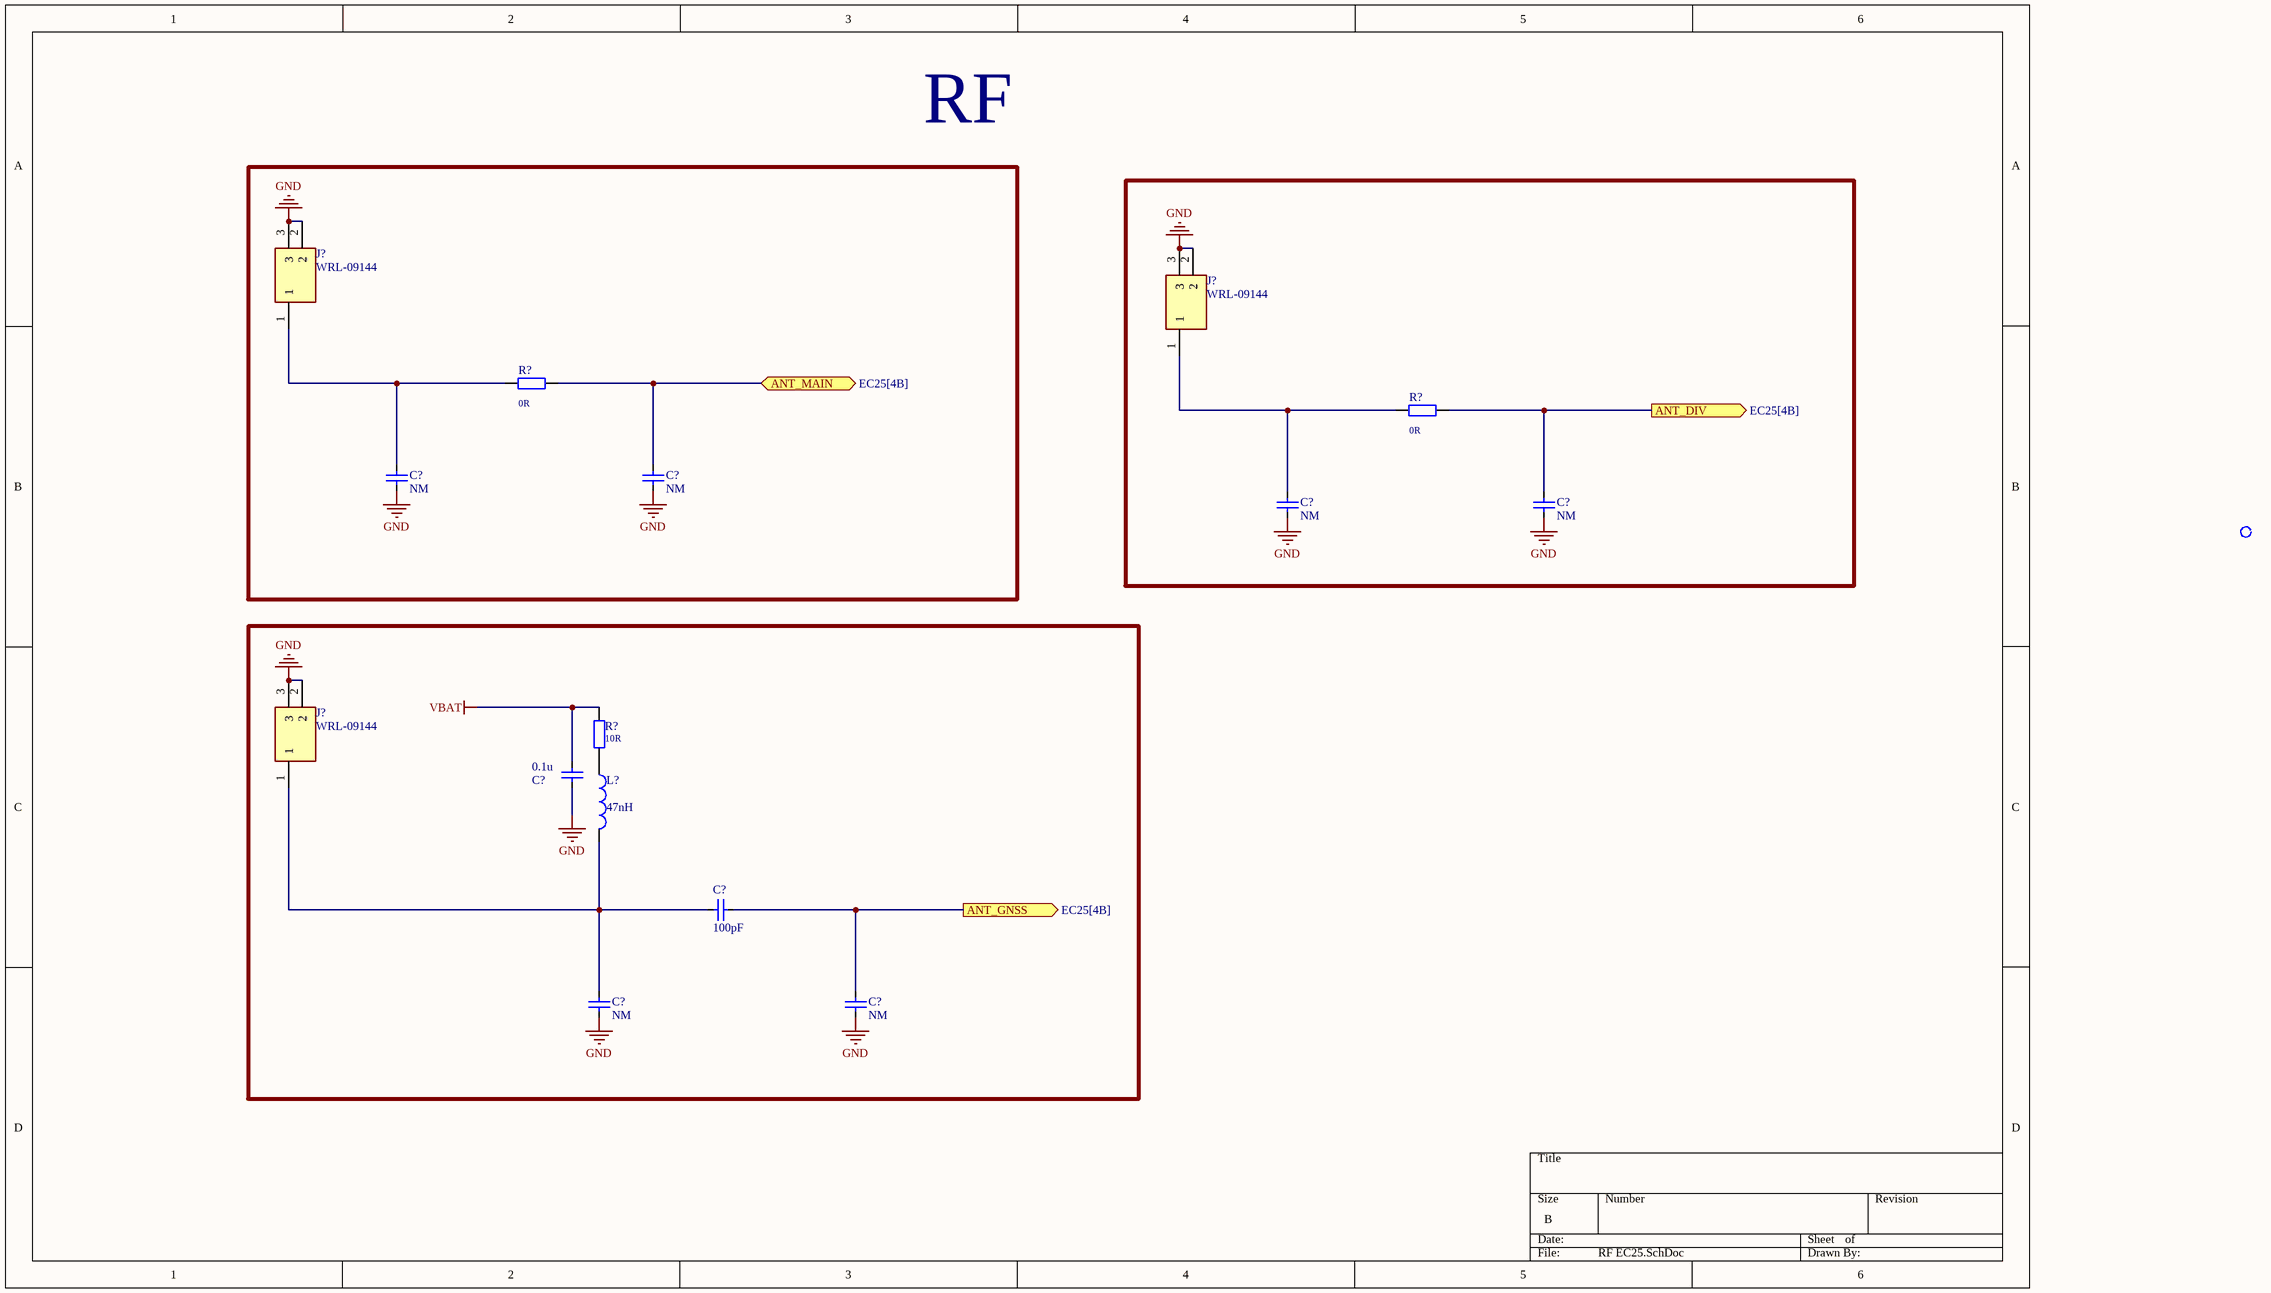
[diagram p9: RF EC25.SchDoc]

### Parts
(Parts that share a designator on the sheet are numbered #1, #2 ... from top to bottom, then left to right.)
C?#22  value NM  [CAPC1005X06N]  (hidden comment: C)
C?#23  value NM  [CAPC1005X06N]  (hidden comment: C)
C?#24  value NM  [CAPC1005X06N]  (hidden comment: C)
C?#25  value NM  [CAPC1005X06N]  (hidden comment: C)
C?#26  value 0.1u  [CAPC1005X06N]  (hidden comment: C)
C?#27  value 100pF  [CAPC1005X06N]  (hidden comment: C)
C?#28  value NM  [CAPC1005X06N]  (hidden comment: C)
C?#29  value NM  [CAPC1005X06N]  (hidden comment: C)
J?#3  WRL-09144  [WRL09144]
J?#4  WRL-09144  [WRL09144]
J?#5  WRL-09144  [WRL09144]
L?#1  value 47nH  [INDP6060X57N]  (hidden comment: L)
R?#30  value 0R  [RESC1005X04N]  (hidden comment: R)
R?#31  value 0R  [RESC1005X04N]  (hidden comment: R)
R?#32  value 10R  [RESC1005X04N]  (hidden comment: R)

### Ports
ANT_DIV (out, see EC25[4B]), ANT_GNSS (out, see EC25[4B]), ANT_MAIN (bidir, see EC25[4B])

### Nets
GND: C?#22.1 C?#23.1 C?#24.1 C?#25.1 C?#26.2 C?#28.1 C?#29.1 J?#3.2 J?#3.3 J?#4.2 J?#4.3 J?#5.2 J?#5.3  [project net VSS_1]
VBAT: C?#26.1 R?#32.2
NetC?#22_2: C?#22.2 J?#3.1 R?#30.1
NetC?#23_2: C?#23.2 R?#30.2 ; port ANT_MAIN
NetC?#24_2: C?#24.2 J?#4.1 R?#31.1
NetC?#25_2: C?#25.2 R?#31.2 ; port ANT_DIV
NetC?#27_1: C?#27.1 C?#29.2 ; port ANT_GNSS
NetC?#27_2: C?#27.2 C?#28.2 J?#5.1 L?#1.2
NetL?#1_1: L?#1.1 R?#32.1

### Notes on the sheet
- RF

### Library data of the parts
J?#3-J?#5 = WRL-09144: Connector; Manufacturer_Name: SparkFun; Datasheet Link: http://cdn.sparkfun.com/datasheets/Wireless/Antennas/RF-001001.pdf; Height: 2.35mm; Manufacturer_Part_Number: WRL-09144; Mouser Part Number: 474-WRL-09144; Mouser Price/Stock: https://www.mouser.co.uk/ProductDetail/SparkFun/WRL-09144/?qs=WyAARYrbSnY0QxfAwjKRnw%3D%3D; Arrow Part Number: WRL-09144; Arrow Price/Stock: https://www.arrow.com/en/products/wrl-09144/sparkfun-electronics
C?#22-C?#29 = C: MPN: *; Link: *
L?#1 = L: MPN: *; Link: *
R?#30-R?#32 = R: MPN: *; Link: *